# EasyEDA schematic SCH_SLV258-存贮式数字毫秒计项目_2026-06-08.json
TITLE: Sheet_1; REV: 1.0; Date: 2026-06-03; Sheet: 1/1; Drawn By: zchzch; Company: Your Company
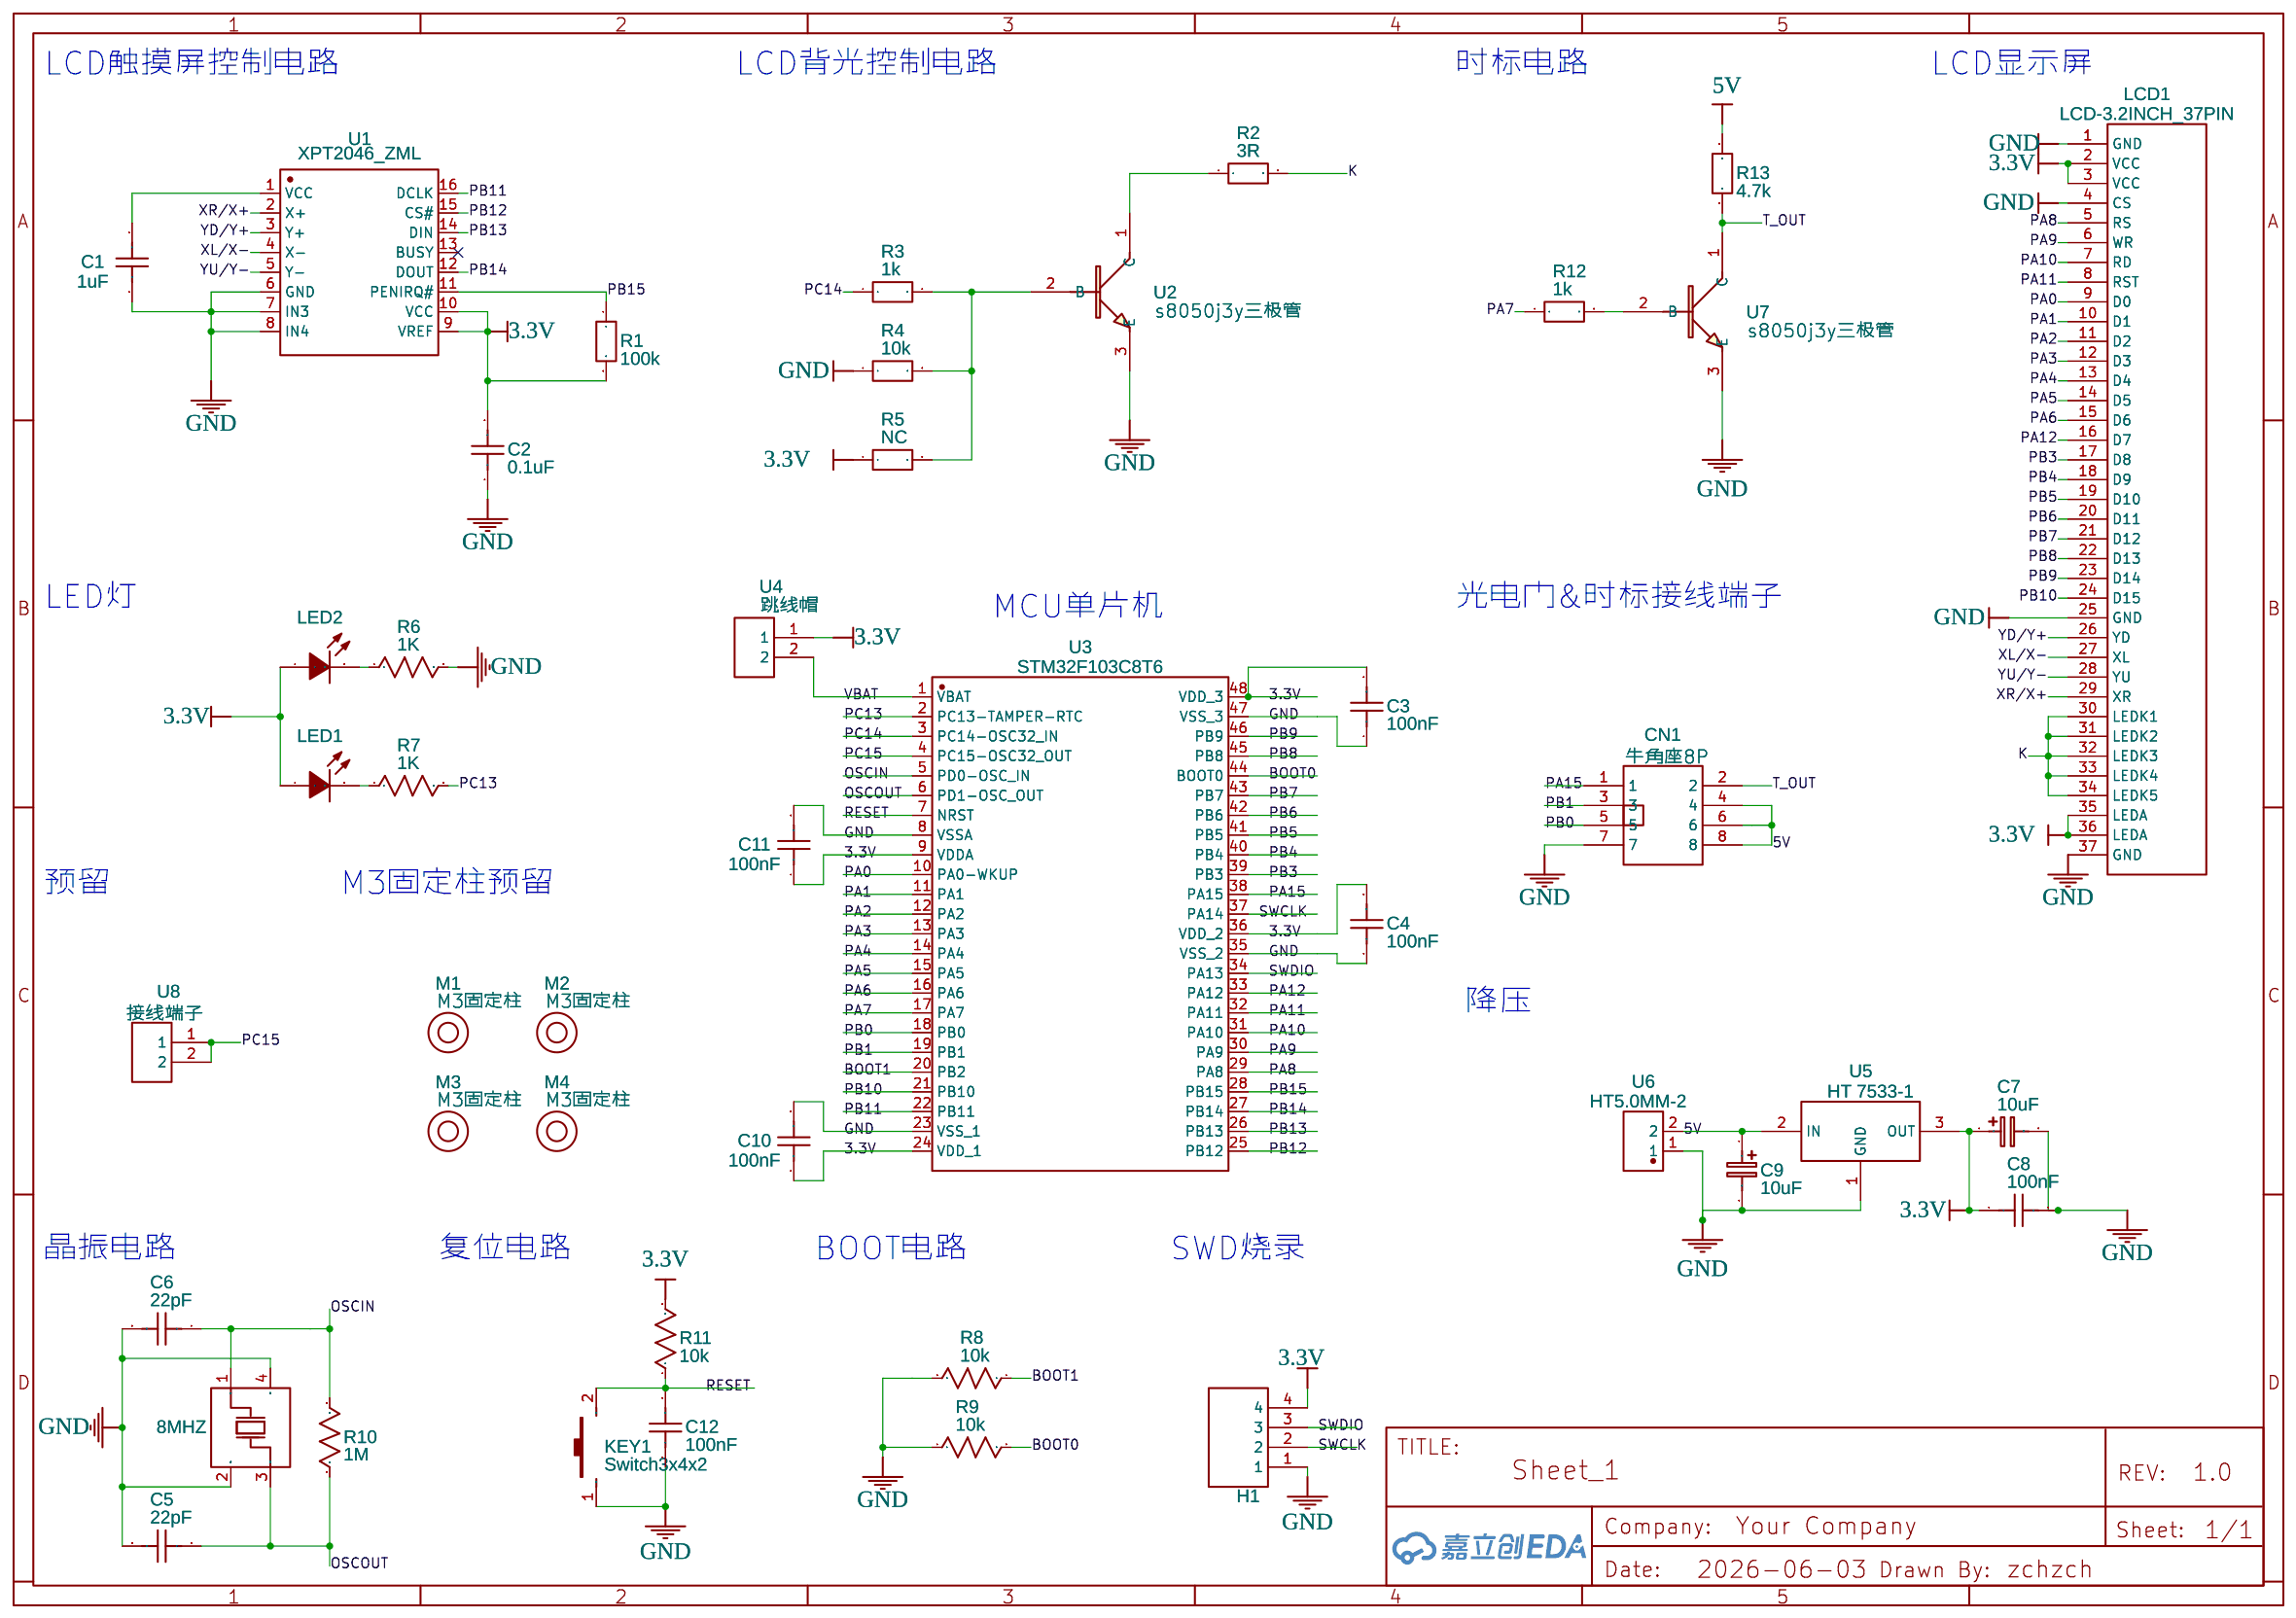
[diagram p0: schematic sheet]

## Parts
8MHZ  3225-20MHZ-15PF-10PPM  [CRYSTAL-SMD_4P-L3.2-W2.5-BL]
C1  1uF  [C0603]
C2  0.1uF  [C0603]
C3  100nF  [C0603]
C4  100nF  [C0603]
C5  22pF  [C0603]
C6  22pF  [C0603]
C7  10uF  [CASE-A_3216]
C8  100nF  [C0603]
C9  10uF  [CASE-A_3216]
C10  100nF  [C0603]
C11  100nF  [C0603]
C12  100nF  [C0603]
CN1  牛角座8P  [牛角座8P]
H1  220S-1*4P H=8.5MM Ytype Gold-plated  [DIP-1X4P2.54]
KEY1  Switch3x4x2  [KEY-3.0*4.0]
LCD1  LCD-3.2INCH_37PIN  [HSD3.2]
LED1  204-10SURD/S530-A3  [LED0805-RD]
LED2  204-10SURD/S530-A3  [LED0805-RD]
M1  M3固定柱  [M3螺丝孔外直径6MM-带8小孔]
M2  M3固定柱  [M3螺丝孔外直径6MM-带8小孔]
M3  M3固定柱  [M3螺丝孔外直径6MM-带8小孔]
M4  M3固定柱  [M3螺丝孔外直径6MM-带8小孔]
R1  100k  [R0603]
R2  3R  [R0603]
R3  1k  [R0603]
R4  10k  [R0603]
R5  NC  [R0603]
R6  1K  [R0603]
R7  1K  [R0603]
R8  10k  [R0603]
R9  10k  [R0603]
R10  1M  [R0603]
R11  10k  [R0603]
R12  1k  [R0603]
R13  4.7k  [R0603]
U1  XPT2046_ZML  [XPT2046_TSSOP16_ZML]
U2  s8050j3y三极管  [J3Y电阻]
U3  STM32F103C8T6  [LQFP-48_L7.0-W7.0-P0.50-LS9.0-BL]
U4  跳线帽  [2P跳线帽]
U5  HT 7533-1  [HT7533-1]
U6  HT5.0MM-2  [CONN-TH_2P-P5.08_HT5.08]
U7  s8050j3y三极管  [J3Y电阻]
U8  接线端子  [2P跳线帽]

## Library data of the parts
8MHZ = 3225-20MHZ-15PF-10PPM: Supplier Part: C337680; Manufacturer: TKD(泰晶); Supplier Footprint: SMD3225-4P; Datasheet: https://atta.szlcsc.com/upload/public/pdf/source/20190802/C337680_9848D2534D79F605CBAF32E63A57FC37.pdf; Supplier: LCSC; Add into BOM: yes; Convert to PCB: yes; Contributor: sabrita
C1-C4 C8 C10 C11 = C_0603_US: Contributor: LCEDA_Lib
C5 C6 C12 = Cap_RAD-0.1_US
C7 C9 = C_Tan_SMD_A_EU: Contributor: LCEDA_Lib
CN1 = 牛角座8P: Contributor: 小禹治水
H1 = 220S-1*4P H=8.5MM Ytype Gold-plated: Supplier: LCSC; Manufacturer: Ckmtw; Contributor: LCSC; Supplier Part: C124413
KEY1 = Switch3x4x2: Supplier: LCSC; Manufacturer: ReliaPro; Supplier Part: C26638
LCD1 = LCD-3.2INCH_37PIN: Supplier: 鸿讯电子; Contributor: zhuchunlai; 淘宝链接: https://item.taobao.com/item.htm?_u=t2lrb71na763&id=757148877235&spm=a1z09.2.0.0.39da2e8dsnGZgU&skuId=5223387253940
LED1 LED2 = 204-10SURD/S530-A3: Supplier: LCSC; Manufacturer: EVERLIGHT; Supplier Part: C99772
M1-M4 = M3固定柱: Contributor: lazyshark
R1-R5 R12 R13 = R_0603_EU: Contributor: LCEDA_Lib
R6-R11 = Res_AXIAL-0.3(1/8W)_US
U1 = XPT2046_ZML: Supplier: LCSC; Manufacturer: XPT; Manufacturer Part: XPT2046; Supplier Part: C19076; SMT Type: Extend; JLCPCB SMD: Yes; Contributor: lhq98
U2 U7 = j3y三极管: Contributor: 123r3
U3 = STM32F103C8T6: Supplier: LCSC; Manufacturer: STMicroelectronics; LCSC Assembly: Yes; image: //image.lceda.cn/szlcsc/C8734.jpg; Supplier Part: C8734; SMT Type: Basic
U4 U8 = 跳线帽: Contributor: newaijnehc
U5 = HT 7533-1: Contributor: FEIJIU
U6 = HT3.96MM-2: Contributor: lcsc; Supplier: LCSC; Supplier Part: C9900013550; Manufacturer: null; JLCPCB Part Class: Extended Part

## Nets
3.3V: C2.2 C3.2 C4.2 C7.1 C8.1 C10.1 C11.1 H1.4 LCD1.2(VCC) LCD1.3(VCC) LCD1.35(LEDA) LCD1.36(LEDA) LED1.1(A) LED2.1(A) R1.2 R5.1 R11.2 U1.9(VREF) U1.10(VCC) U3.9(VDDA) U3.24(VDD_1) U3.36(VDD_2) U3.48(VDD_3) U4.1 U5.3(OUT)
5V: C9.1 CN1.4 CN1.6 CN1.8 R13.2 U5.2(IN) U6.2
GND: 8MHZ.2(GND) 8MHZ.4(GND) C1.1 C2.1 C3.1 C4.1 C5.2 C6.2 C7.2 C8.2 C9.2 C10.2 C11.2 C12.1 CN1.7 H1.1 KEY1.1 LCD1.1(GND) LCD1.4(CS) LCD1.25(GND) LCD1.37(GND) R4.1 R6.2 R8.2 R9.1 U1.6(GND) U1.7(IN3) U1.8(IN4) U2.3(E) U3.8(VSSA) U3.23(VSS_1) U3.35(VSS_2) U3.47(VSS_3) U5.1(GND) U6.1 U7.3(E)
VBAT: U3.1(VBAT) U4.2
BOOT0: R9.2 U3.44(BOOT0)
BOOT1: R8.1 U3.20(PB2)
K: LCD1.30(LEDK1) LCD1.31(LEDK2) LCD1.32(LEDK3) LCD1.33(LEDK4) LCD1.34(LEDK5) R2.2
OSCIN: 8MHZ.1(OSC1) C6.1 R10.2 U3.5(PD0-OSC_IN)
OSCOUT: 8MHZ.3(OSC2) C5.1 R10.1 U3.6(PD1-OSC_OUT)
PA0: LCD1.9(D0) U3.10(PA0-WKUP)
PA1: LCD1.10(D1) U3.11(PA1)
PA2: LCD1.11(D2) U3.12(PA2)
PA3: LCD1.12(D3) U3.13(PA3)
PA4: LCD1.13(D4) U3.14(PA4)
PA5: LCD1.14(D5) U3.15(PA5)
PA6: LCD1.15(D6) U3.16(PA6)
PA7: R12.1 U3.17(PA7)
PA8: LCD1.5(RS) U3.29(PA8)
PA9: LCD1.6(WR) U3.30(PA9)
PA10: LCD1.7(RD) U3.31(PA10)
PA11: LCD1.8(RST) U3.32(PA11)
PA12: LCD1.16(D7) U3.33(PA12)
PA15: CN1.1 U3.38(PA15)
PB0: CN1.5 U3.18(PB0)
PB1: CN1.3 U3.19(PB1)
PB3: LCD1.17(D8) U3.39(PB3)
PB4: LCD1.18(D9) U3.40(PB4)
PB5: LCD1.19(D10) U3.41(PB5)
PB6: LCD1.20(D11) U3.42(PB6)
PB7: LCD1.21(D12) U3.43(PB7)
PB8: LCD1.22(D13) U3.45(PB8)
PB9: LCD1.23(D14) U3.46(PB9)
PB10: LCD1.24(D15) U3.21(PB10)
PB11: U1.16(DCLK) U3.22(PB11)
PB12: U1.15(CS#) U3.25(PB12)
PB13: U1.14(DIN) U3.26(PB13)
PB14: U1.12(DOUT) U3.27(PB14)
PB15: R1.1 U1.11(PENIRQ#) U3.28(PB15)
PC13: R7.2 U3.2(PC13-TAMPER-RTC)
PC14: R3.1 U3.3(PC14-OSC32_IN)
PC15: U3.4(PC15-OSC32_OUT) U8.1 U8.2
RESET: C12.2 KEY1.2 R11.1 U3.7(NRST)
SWCLK: H1.2 U3.37(PA14)
SWDIO: H1.3 U3.34(PA13)
T_OUT: CN1.2 R13.1 U7.1(C)
XL/X-: LCD1.27(XL) U1.4(X-)
XR/X+: LCD1.29(XR) U1.2(X+)
YD/Y+: LCD1.26(YD) U1.3(Y+)
YU/Y-: LCD1.28(YU) U1.5(Y-)
Net-(C1-2): C1.2 U1.1(VCC)
Net-(LED1-2): LED1.2(K) R7.1
Net-(LED2-2): LED2.2(K) R6.1
Net-(R2-1): R2.1 U2.1(C)
Net-(R3-2): R3.2 R4.2 R5.2 U2.2(B)
Net-(R12-2): R12.2 U7.2(B)

Not connected (* = marked no-connect by the designer): U1 13(BUSY)*

## Notes on the sheet
- LCD触摸屏控制电路
- LCD背光控制电路
- 时标电路
- LCD显示屏
- LED灯
- 光电门&时标接线端子
- MCU单片机
- 预留
- M3固定柱预留
- 降压
- 晶振电路
- 复位电路
- BOOT电路
- SWD烧录
